# EAGLE design EstacionMetro (EAGLE 7.6.0)
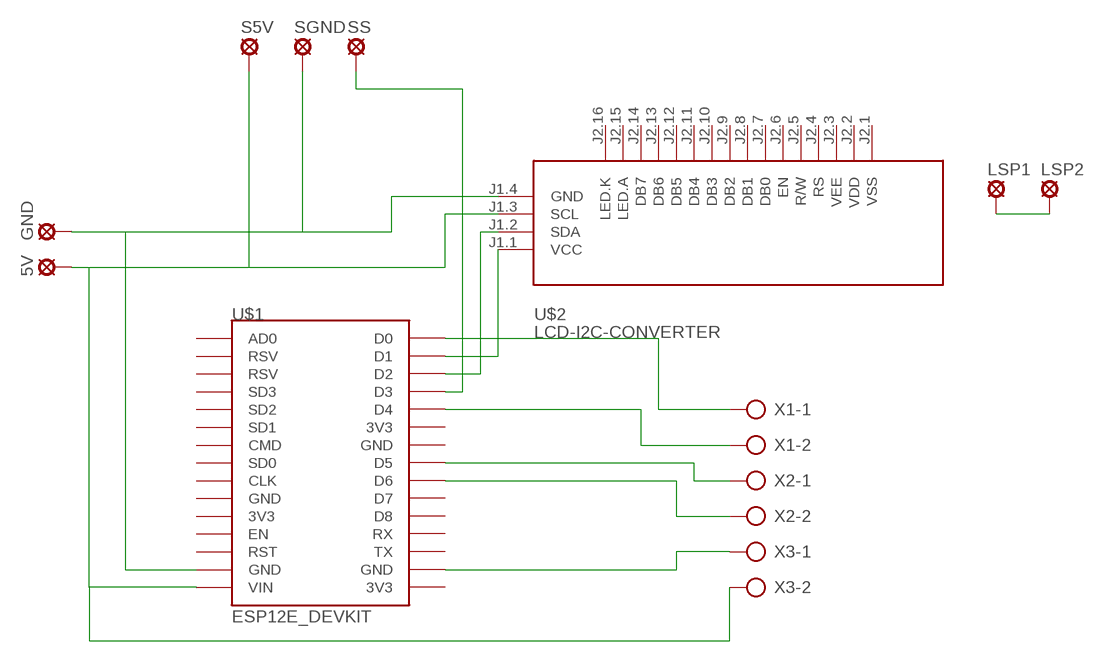
[diagram p0: schematic, sheet 1]

## Parts
5V  SE11  [SE11]
GND  SE11  [SE11]
LSP1  SE11  [SE11]
LSP2  SE11  [SE11]
S5V  SE11  [SE11]
SGND  SE11  [SE11]
SS  SE11  [SE11]
U$1  ESP12E_DEVKIT  [ESP12E_DEVKIT]
U$2  LCD-I2C-CONVERTER  [LCD-I2C-CONVERTER]
X1  AK500/2  [AK500/2]
X2  AK500/2  [AK500/2]
X3  AK500/2  [AK500/2]

## Nets
N$1: SS.MP U$1.D3
N$2: 5V.MP S5V.MP U$1.VIN U$2.J1.3(SCL) X3.2
N$3: U$1.D1 U$2.J1.1(VCC)
N$4: U$1.D2 U$2.J1.2(SDA)
N$5: LSP1.MP LSP2.MP
N$6: GND.MP SGND.MP U$1.GND@1(GND) U$2.J1.4(GND)
N$7: U$1.D0 X1.1
N$8: U$1.D4 X1.2
N$9: U$1.D5 X2.1
N$10: U$1.D6 X2.2
N$11: U$1.GND@3(GND) X3.1
Unconnected: U$1.3V3@0(3V3) U$1.3V3@1(3V3) U$1.3V3@2(3V3) U$1.AD0 U$1.CLK U$1.CMD U$1.D7 U$1.D8 U$1.EN U$1.GND@0(GND) U$1.GND@2(GND) U$1.RST U$1.RSV@0(RSV) U$1.RSV@1(RSV) U$1.RX U$1.SD0 U$1.SD1 U$1.SD2 U$1.SD3 U$1.TX U$2.J2.1(VSS) U$2.J2.2(VDD) U$2.J2.3(VEE) U$2.J2.4(RS) U$2.J2.5(R/W) U$2.J2.6(EN) U$2.J2.7(DB0) U$2.J2.8(DB1) U$2.J2.9(DB2) U$2.J2.10(DB3) U$2.J2.11(DB4) U$2.J2.12(DB5) U$2.J2.13(DB6) U$2.J2.14(DB7) U$2.J2.15(LED.A) U$2.J2.16(LED.K)

## Library data of the parts
5V GND LSP1 LSP2 S5V SGND SS = solpad:SE11: SOLDER PAD RTM, drill 1,1mm, distributor Buerklin, 07F810
U$1 = ESP12E_DEVKIT:ESP12E_DEVKIT: ESP12E DEVKIT BOARD
U$2 = diy-modules:LCD-I2C-CONVERTER: I2C Bus to 4-Bit Parallel LCD Interface with LED backlight driver
X1-X3 = con-ptr500:AK500/2: CONNECTOR; OC_FARNELL: unknown; OC_NEWARK: unknown

## Board
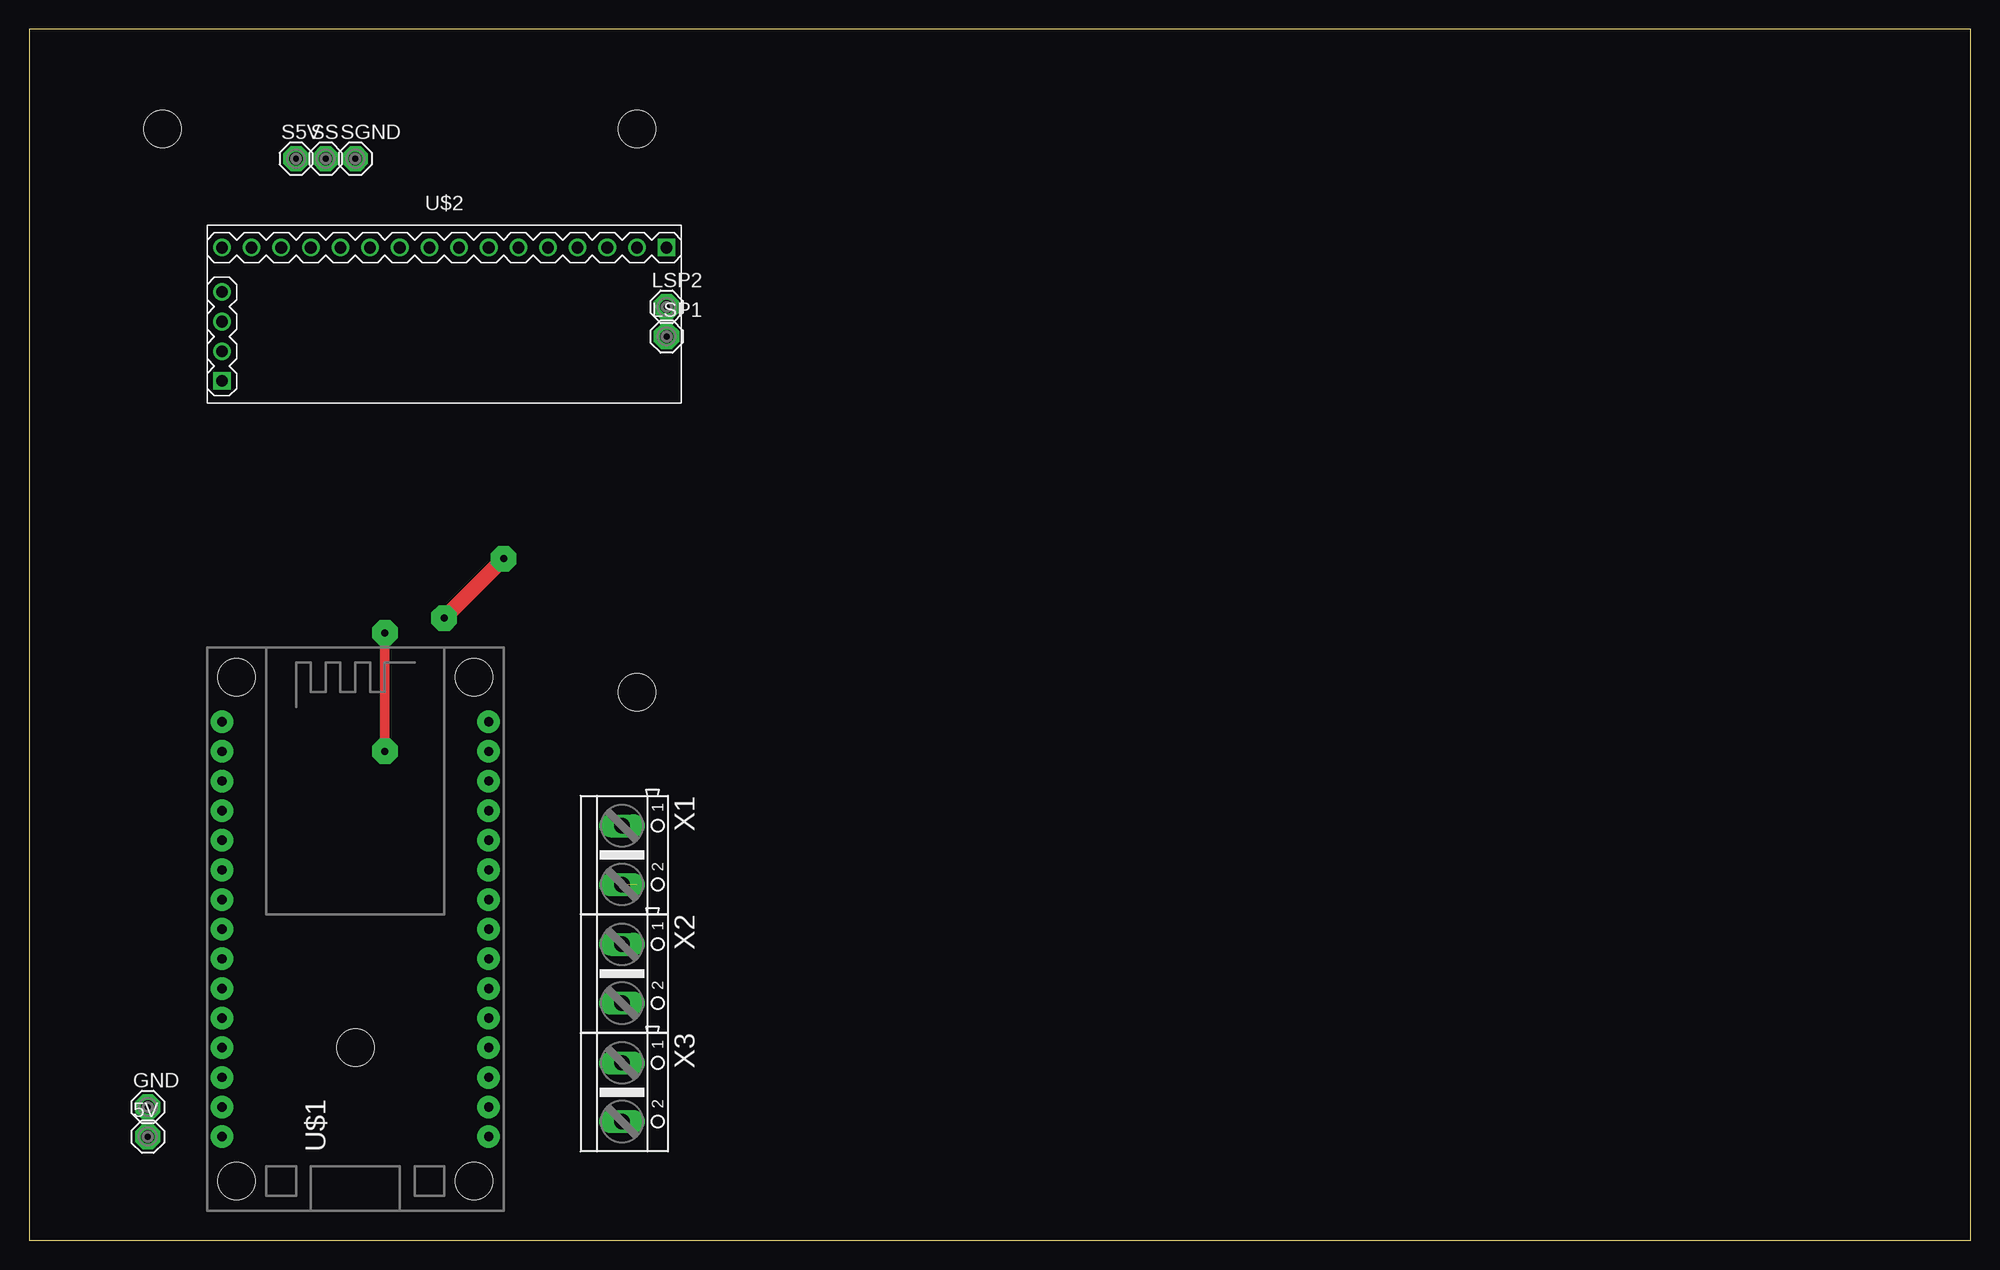
[diagram p1: board, top side]
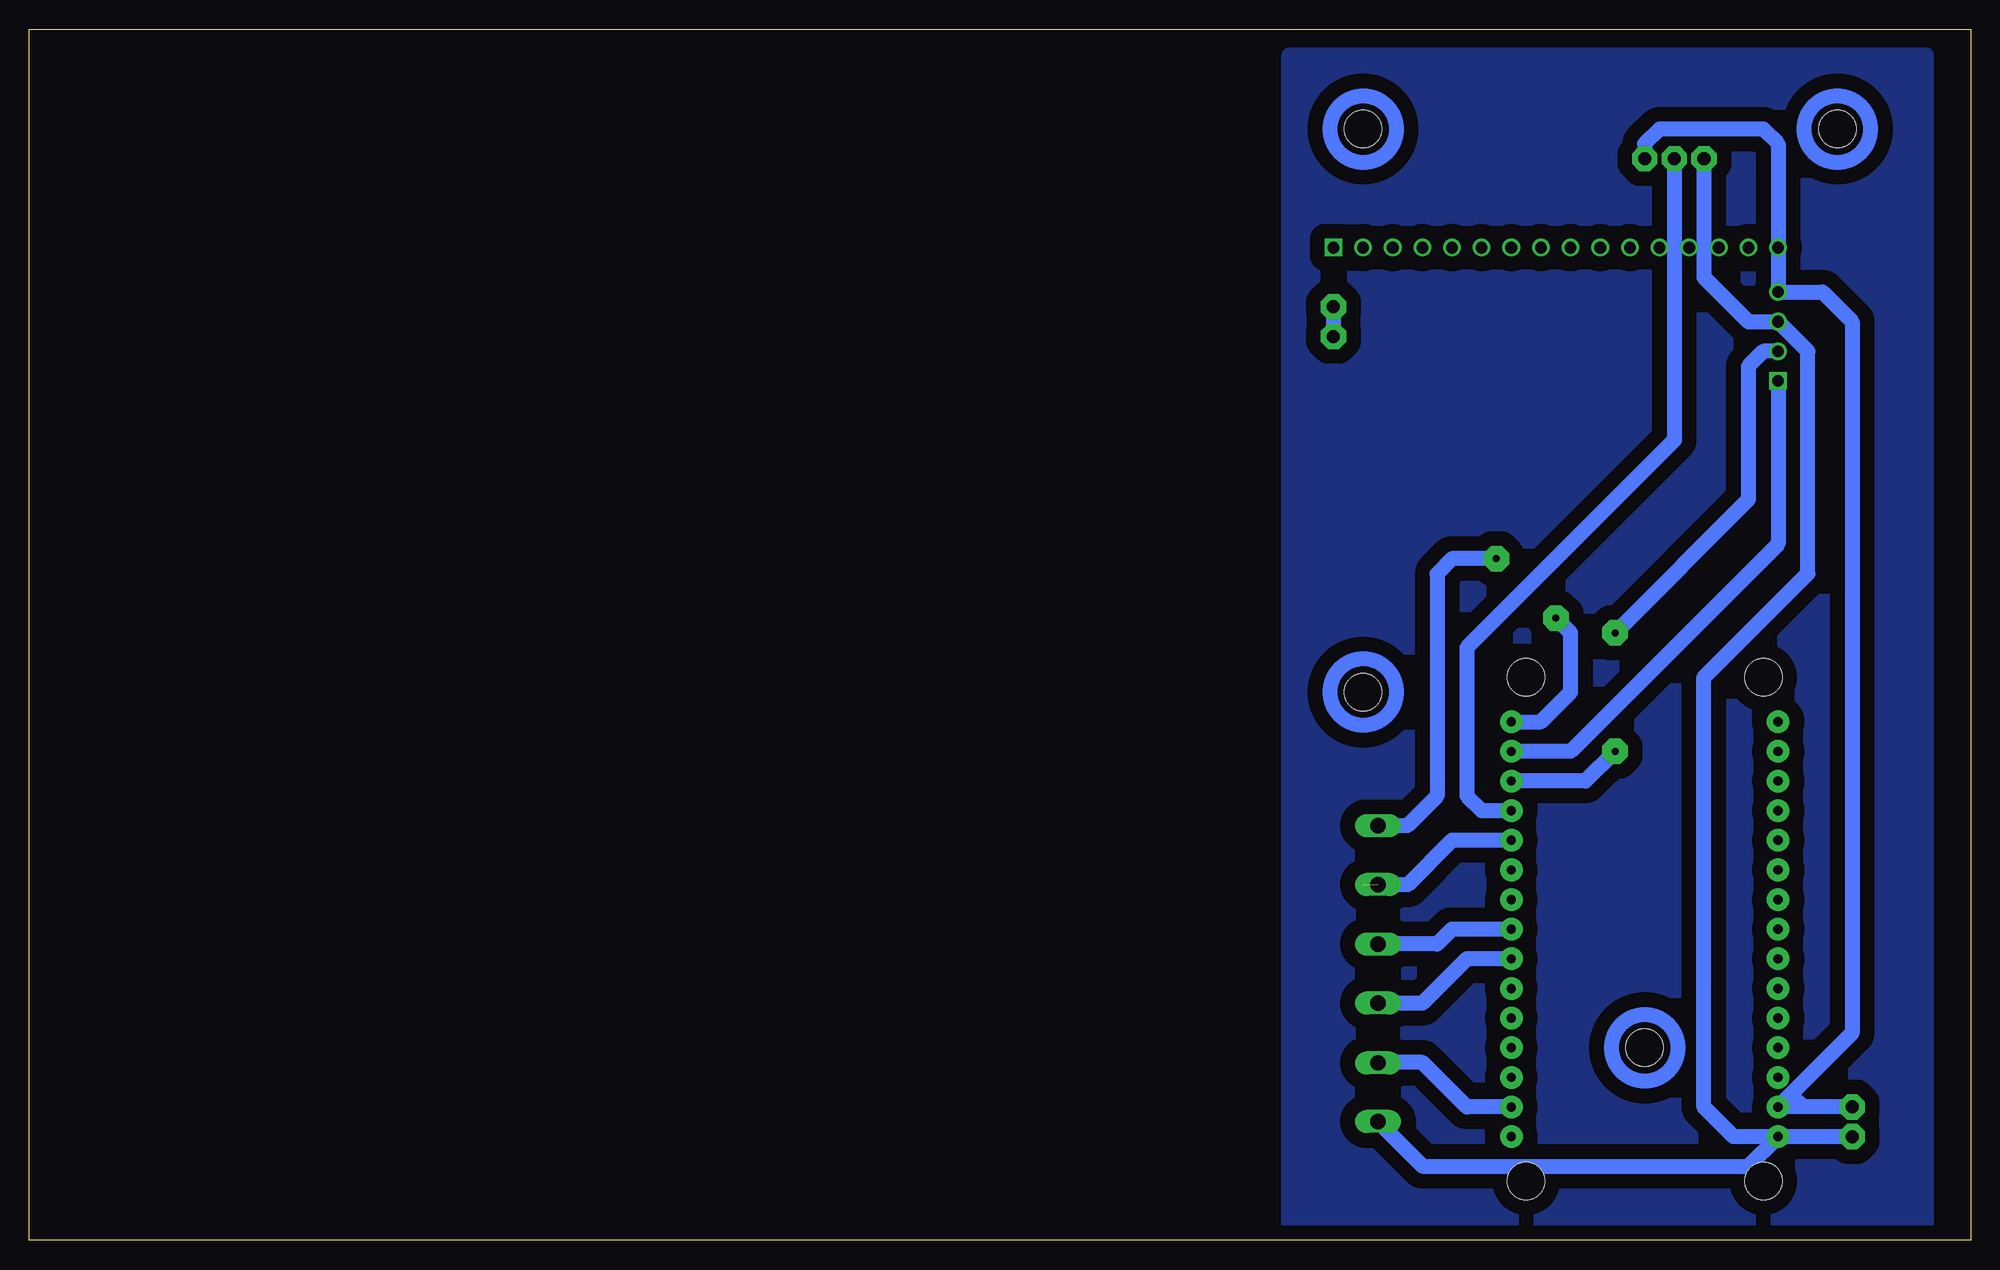
[diagram p2: board, bottom side, seen from below]

Size 166.35 x 103.81 mm. Coordinates in mm from the lower left corner, seen from the top.
Outline: 0,0 166.35,0 166.35,103.81 0,103.81 0,0
Copper layers (1*16): Top 0.035mm / dielectric 1.5mm / Bottom 0.035mm
Design rules "default": minimum track width 10mil, minimum drill 24mil, track to track 8mil, track to pad 8mil, pad to pad 8mil, via to via 8mil, smd to smd 8mil, copper to edge 40mil, drill to drill 8mil, minimum pad ring 10mil, minimum via ring 8mil, stop-mask expansion 4mil, vias tented up to drill 0mil, thermal gap 10mil
Holes 3.2 mm at 11.43,95.25 52.07,95.25 52.07,46.99 27.94,16.51

### Footprints (pad centres in the part's own frame; a part is rotated, then mirrored left to right if it is on the bottom)
SE11 = drill 1.118 pad 2.159 octagon: MP 0,0
ESP12E_DEVKIT = drill 0.8 pad 1.93: 3V3@0 -11.43,-7.62; 3V3@1 11.43,5.08; 3V3@2 11.43,-17.78; AD0 -11.43,17.78; CLK -11.43,-2.54; CMD -11.43,2.54; D0 11.43,17.78; D1 11.43,15.24; D2 11.43,12.7; D3 11.43,10.16; D4 11.43,7.62; D5 11.43,0; D6 11.43,-2.54; D7 11.43,-5.08; D8 11.43,-7.62; EN -11.43,-10.16; GND@0 -11.43,-5.08; GND@1 -11.43,-15.24; GND@2 11.43,2.54; GND@3 11.43,-15.24; RST -11.43,-12.7; RSV@0 -11.43,15.24; RSV@1 -11.43,12.7; RX 11.43,-10.16; SD0 -11.43,0; SD1 -11.43,5.08; SD2 -11.43,7.62; SD3 -11.43,10.16; TX 11.43,-12.7; VIN -11.43,-17.78 | hole 3.2: -10.16,21.59; 10.16,21.59; 10.16,-21.59; -10.16,-21.59
LCD-I2C-CONVERTER = drill 1 square: J1.1 -19.05,-5.08; J2.1 19.05,6.35 | drill 1: J1.2 -19.05,-2.54; J1.3 -19.05,0; J1.4 -19.05,2.54; J2.2 16.51,6.35; J2.3 13.97,6.35; J2.4 11.43,6.35; J2.5 8.89,6.35; J2.6 6.35,6.35; J2.7 3.81,6.35; J2.8 1.27,6.35; J2.9 -1.27,6.35; J2.10 -3.81,6.35; J2.11 -6.35,6.35; J2.12 -8.89,6.35; J2.13 -11.43,6.35; J2.14 -13.97,6.35; J2.15 -16.51,6.35; J2.16 -19.05,6.35
AK500/2 = drill 1.321 long: 1 -2.515,0; 2 2.515,0

### Placement (x,y rotation side)
5V  10.16,8.89 0 top
GND  10.16,11.43 0 top
LSP1  54.61,77.47 0 top
LSP2  54.61,80.01 0 top
S5V  22.86,92.71 0 top
SGND  27.94,92.71 0 top
SS  25.4,92.71 0 top
U$1  27.94,26.67 0 top
U$2  35.56,78.74 0 top
X1  50.8,33.02 270 top
X2  50.8,22.86 270 top
X3  50.8,12.7 270 top

### Tracks (layer width: path | path; a pad name or v marks a point on that pad's centre or on a via)
N$1
  Bottom 1.27: SS.MP 25.4,68.58 43.18,50.8 43.18,38.1 41.91,36.83 U$1.D3
N$2
  Bottom 1.27: 5V.MP U$1.VIN | U$1.VIN 20.32,8.89 22.86,11.43 22.86,48.26 13.97,57.15 13.97,76.2 U$2.J1.3 19.05,78.74 22.86,82.55 S5V.MP | X3.2 46.97,6.35 19.05,6.35 U$1.VIN
N$3
  Bottom 1.27: U$2.J1.1 16.51,59.69 34.29,41.91 U$1.D1
N$4  (via drill 0.6, 0.6 pad 1.68, 0.6 pad 2.18)
  Top 0.813: v30.48,52.07 v30.48,41.91
  Bottom 1.27: v30.48,41.91 33.02,39.37 U$1.D2 | U$2.J1.2 17.78,76.2 19.05,74.93 19.05,63.5 v30.48,52.07
N$5
  Bottom 1.27: LSP2.MP LSP1.MP
N$6
  Bottom 0.813: GND.MP 13.97,11.43 | 13.97,11.43 15.24,11.43 | 15.24,11.43 U$1.GND@1 15.24,12.7 | 10.16,17.78 15.24,12.7 | 15.24,12.7 15.24,11.43 | 13.97,11.43 15.24,12.7
  Bottom 1.27: GND.MP U$1.GND@1 10.16,17.78 10.16,78.74 12.7,81.28 U$2.J1.4 16.51,93.98 17.78,95.25 26.67,95.25 27.94,93.98 SGND.MP
N$7  (via drill 0.6, 0.6 pad 1.68, 0.6 pad 2.18)
  Top 1.27: v35.56,53.34 v40.64,58.42
  Bottom 1.27: U$1.D0 36.83,44.45 34.29,46.99 34.29,52.07 v35.56,53.34 | v40.64,58.42 44.45,58.42 45.72,57.15 45.72,38.1 48.29,35.54 X1.1
N$8  (1 unrouted)
  Bottom 1.27: U$1.D4 44.45,34.29 48.26,30.48 52.07,30.48
N$9
  Bottom 1.27: U$1.D5 44.45,26.67 45.72,25.4 50.77,25.4 X2.1
N$10
  Bottom 1.27: U$1.D6 43.18,24.13 46.99,20.32 50.77,20.32 X2.2
N$11
  Bottom 1.27: U$1.GND@3 43.18,11.43 46.99,15.24 50.77,15.24 X3.1
N$12
  pour Bottom (isolate 1.27): 3.81,1.27 58.42,1.27 58.42,101.6 3.81,101.6
(copper drawn outside any net)
  shapes: Bottom circle x4